# Altium project MACH_DK.PrjPcb
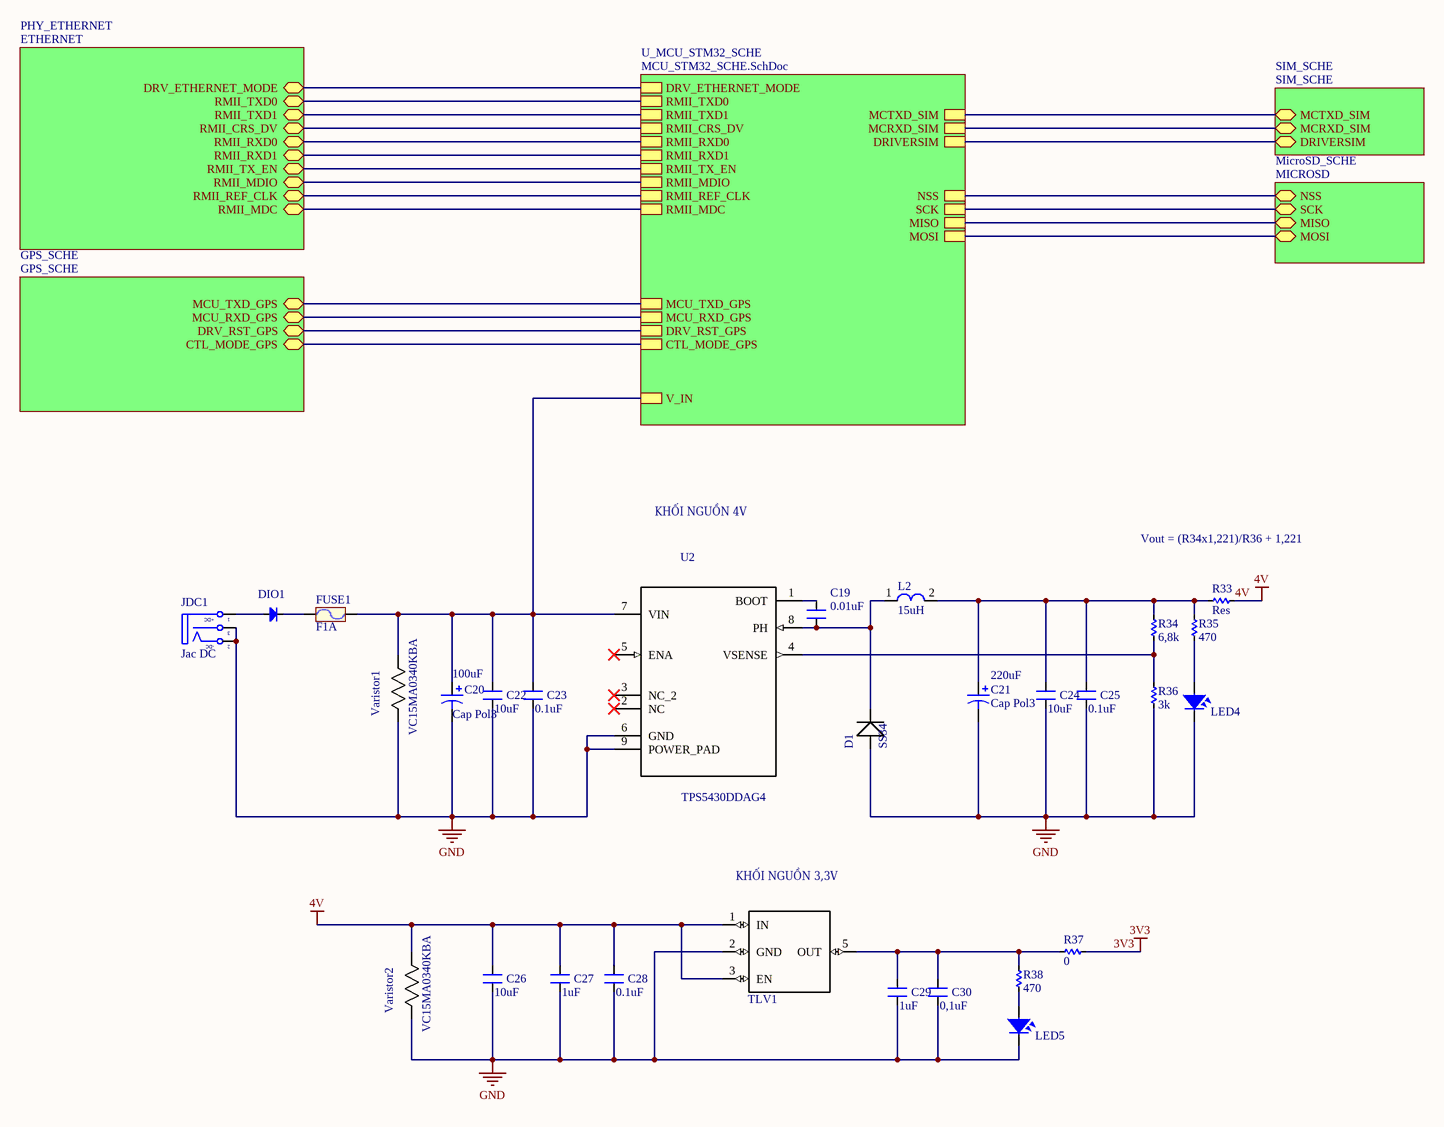
[diagram p0: MAIN_SCHE.SchDoc]
6 sheets, 213 parts. Net scope: hierarchical (ports join the sheet entries above them; power ports are global).
Board file: PCB.PcbDoc
Sheets:
  MAIN_SCHE.SchDoc
    U_MCU_STM32_SCHE = MCU_STM32_SCHE.SchDoc
    MicroSD_SCHE = MICROSD.SchDoc
    SIM_SCHE = SIM_SCHE.SchDoc
    PHY_ETHERNET = ETHERNET.SchDoc
    GPS_SCHE = GPS_SCHE.SchDoc

## Sheet MAIN_SCHE.SchDoc
size A3

### Parts
C19  0.01uF  [res 0805 - duplicate]
C20  Cap Pol3  value 100uF  [cap_100uf]
C21  Cap Pol3  value 220uF  [Cap_tant_220uF]
C22  10uF  [res 0805 - duplicate]
C23  0.1uF  [res 0805 - duplicate]
C24  10uF  [res 0805 - duplicate]
C25  0.1uF  [res 0805 - duplicate]
C26  10uF  [res 0805 - duplicate]
C27  1uF  [res 0805 - duplicate]
C28  0.1uF  [res 0805 - duplicate]
C29  1uF  [res 0805 - duplicate]
C30  0,1uF  [res 0805 - duplicate]
D1  SS34  [SS34]
DIO1  Diode SMD  [DIOT-SS24]  (value not drawn)
FUSE1  F1A  [fuse]
JDC1  Jac DC  [DC-IN]
L2  15uH  [L-15uH]
LED4  LED  [res 0805 - duplicate]  (value not drawn)
LED5  LED  [res 0805 - duplicate]  (value not drawn)
R33  Res  [res 0805 - duplicate]
R34  6,8k  [res 0805 - duplicate]
R35  470  [res 0805 - duplicate]
R36  3k  [res 0805 - duplicate]
R37  0  [res 0805 - duplicate]
R38  470  [res 0805 - duplicate]
TLV1  TLV70233DBVR  [SOT23-5]  (value not drawn)
U2  TPS5430DDAG4  [SOIC127P600X170-9N]
Varistor1  VC15MA0340KBA  [varistor]
Varistor2  VC15MA0340KBA  [varistor]

### Sub-sheets
GPS_SCHE = GPS_SCHE: MCU_TXD_GPS, MCU_RXD_GPS, DRV_RST_GPS, CTL_MODE_GPS
MicroSD_SCHE = MICROSD: NSS, SCK, MISO, MOSI
PHY_ETHERNET = ETHERNET: DRV_ETHERNET_MODE, RMII_TXD0, RMII_TXD1, RMII_CRS_DV, RMII_RXD0, RMII_RXD1, RMII_TX_EN, RMII_MDIO, RMII_REF_CLK, RMII_MDC
SIM_SCHE = SIM_SCHE: MCTXD_SIM, MCRXD_SIM, DRIVERSIM
U_MCU_STM32_SCHE = MCU_STM32_SCHE.SchDoc: DRV_ETHERNET_MODE, RMII_TXD0, RMII_TXD1, RMII_CRS_DV, RMII_RXD0, RMII_RXD1, RMII_TX_EN, MCTXD_SIM, MCRXD_SIM, DRIVERSIM, MCU_TXD_GPS, MCU_RXD_GPS, DRV_RST_GPS, CTL_MODE_GPS, NSS, SCK, MISO, MOSI, RMII_MDIO, RMII_REF_CLK, RMII_MDC, V_IN

### Nets
3V3: R37.1
4V: C26.2 C27.2 C28.2 R33.1 TLV1.1(IN) TLV1.3(EN) Varistor2.1(R1)
GND: C20.2 C21.2 C22.1 C23.1 C24.1 C25.1 C26.1 C27.1 C28.1 C29.1 C30.1 D1.1(POS) JDC1.2(TN) JDC1.3(S) LED4.2 LED5.2 R36.2 TLV1.2(GND) U2.6(GND) U2.9(POWER_PAD) Varistor1.2(R2) Varistor2.2(R2)
CTL_MODE_GPS: sheet U_MCU_STM32_SCHE/CTL_MODE_GPS, sheet GPS_SCHE/CTL_MODE_GPS
DRIVERSIM: sheet U_MCU_STM32_SCHE/DRIVERSIM, sheet SIM_SCHE/DRIVERSIM
DRV_ETHERNET_MODE: sheet U_MCU_STM32_SCHE/DRV_ETHERNET_MODE, sheet PHY_ETHERNET/DRV_ETHERNET_MODE
DRV_RST_GPS: sheet U_MCU_STM32_SCHE/DRV_RST_GPS, sheet GPS_SCHE/DRV_RST_GPS
MCRXD_SIM: sheet U_MCU_STM32_SCHE/MCRXD_SIM, sheet SIM_SCHE/MCRXD_SIM
MCTXD_SIM: sheet U_MCU_STM32_SCHE/MCTXD_SIM, sheet SIM_SCHE/MCTXD_SIM
MCU_RXD_GPS: sheet U_MCU_STM32_SCHE/MCU_RXD_GPS, sheet GPS_SCHE/MCU_RXD_GPS
MCU_TXD_GPS: sheet U_MCU_STM32_SCHE/MCU_TXD_GPS, sheet GPS_SCHE/MCU_TXD_GPS
MISO: sheet U_MCU_STM32_SCHE/MISO, sheet MicroSD_SCHE/MISO
MOSI: sheet U_MCU_STM32_SCHE/MOSI, sheet MicroSD_SCHE/MOSI
NSS: sheet U_MCU_STM32_SCHE/NSS, sheet MicroSD_SCHE/NSS
OSC_1: sheet U_MCU_STM32_SCHE/RMII_REF_CLK, sheet PHY_ETHERNET/RMII_REF_CLK
RMII_CRS_DV: sheet U_MCU_STM32_SCHE/RMII_CRS_DV, sheet PHY_ETHERNET/RMII_CRS_DV
RMII_MDC: sheet U_MCU_STM32_SCHE/RMII_MDC, sheet PHY_ETHERNET/RMII_MDC
RMII_MDIO: sheet U_MCU_STM32_SCHE/RMII_MDIO, sheet PHY_ETHERNET/RMII_MDIO
RMII_RXD0: sheet U_MCU_STM32_SCHE/RMII_RXD0, sheet PHY_ETHERNET/RMII_RXD0
RMII_RXD1: sheet U_MCU_STM32_SCHE/RMII_RXD1, sheet PHY_ETHERNET/RMII_RXD1
RMII_TX_EN: sheet U_MCU_STM32_SCHE/RMII_TX_EN, sheet PHY_ETHERNET/RMII_TX_EN
RMII_TXD0: sheet U_MCU_STM32_SCHE/RMII_TXD0, sheet PHY_ETHERNET/RMII_TXD0
RMII_TXD1: sheet U_MCU_STM32_SCHE/RMII_TXD1, sheet PHY_ETHERNET/RMII_TXD1
SCK: sheet U_MCU_STM32_SCHE/SCK, sheet MicroSD_SCHE/SCK
V_IN: C20.1 C22.2 C23.2 FUSE1.2 U2.7(VIN) Varistor1.1(R1) ; sheet U_MCU_STM32_SCHE/V_IN
NetC19_1: C19.1 D1.2(NEG) L2.1 U2.8(PH)
NetC19_2: C19.2 U2.1(BOOT)
NetC21_1: C21.1 C24.2 C25.2 L2.2 R33.2 R34.1 R35.1
NetC29_2: C29.2 C30.2 R37.2 R38.2 TLV1.5(OUT)
NetDIO1_1: DIO1.1(A) JDC1.1(T)
NetDIO1_2: DIO1.2(K) FUSE1.1
NetLED4_1: LED4.1 R35.2
NetLED5_1: LED5.1 R38.1
NetR34_2: R34.2 R36.1 U2.4(VSENSE)

Not connected (* = marked no-connect by the designer): U2 2(NC)* 3(NC_2)* 5(ENA)*

### Notes on the sheet
- KHỐI NGUỒN 4V
- Vout = (R34x1,221)/R36 + 1,221
- (near TLV1) KHỐI NGUỒN 3,3V
- (in symbol DCIN) +DC; -DC

### Library data of the parts
C19 C22-C30 = CM: Cap SMD; Value: 103
C20 C21 = Cap Pol3: Polarized Capacitor (Surface Mount); Published: 8-Jun-2000; LatestRevisionDate: 29-May-2009; LatestRevisionNote: IPC-7351 Footprint Added.; PackageReference: C0805; Publisher: Altium Limited; PackageDescription: Chip Capacitor
  C20: wed: https://www.digikey.com/product-detail/en/avx-corporation/TCJE107M020R0045/478-9462-1-ND/5001674
  C21: wed: https://www.digikey.com/product-detail/en/avx-corporation/F930J227MBA/478-8168-6-ND/4006298
D1 = SMD-DIODE-SCHOTTKY-40V-3A(DO-214AB): Rectifier, Schottky; DO-214AB; 3.0A IF; 0.75V; 40V; 100A IFRM; 10000V/us; 1000pF; MF: Vishay; MP: SS34-E3/57T; Digi-Key_Part_Number: SS34-E3/57TGICT-ND; Digi-Key_Purchase_URL: https://www.digikey.com/product-detail/en/vishay-semiconductor-diodes-division/SS34-E3-57T/SS34-E3-57TGICT-ND/1091684?utm_source=snapeda&utm_medium=aggregator&utm_campaign=symbol; SnapEDA_Link: https://www.snapeda.com/parts/SS34-E3/57T/Vishay%20Semiconductor%20Diodes%20Division/view-part/?ref=snap; Package: DO-214 Vishay; Value: *
DIO1 = Diode SMD: Default Diode; Code - JEDEC: DO-214-AB; Value: 1N5007; Published: 8-Jun-2000; Revision: July-2002: Re-released for DXP Platform.; Publisher: Altium Limited
FUSE1 = Fuse: Designed by: VanDungEvn; wed: Fuse https://www.digikey.com/product-detail/en/littelfuse-inc/0466001.NR/F1456TR-ND/521337; Value: Fuse
JDC1 = DCIN: Jac DC input; Value: Jac DC
L2 = L-SMD-1: partNo: 78477010; Manufacturer: Wurth Elektronik; Inductance: 1.0 μH; ComponentLink1Description: Manufacturer; ComponentLink1URL: http://www.we-online.de; Created by: Baojun Chen; Created Date: Nov.2015; ComponentLink2Description: Datasheet; ComponentLink2URL: http://katalog.we-online.de/pbs/datasheet/78477010.pdf
LED4 LED5 = LED SMD: Value: LED 3 - 5 ly 2 Colour
R33-R38 = Res-SMD: Resistor; Manufacturer: Generic Components; Class: Passive; Published: 08/06/2000; Publisher: Altium Hobart Technology Centre
TLV1 = TLV70233DBVR: LDO voltage regulator [Texas Instruments] TLV70233DBVR LDO voltage regulator; MP: TLV70233DBVR; Price: 0.26 USD; Availability: Good; Package: SOT-23-5 Texas Instruments; SnapEDA_Link: https://www.snapeda.com/parts/TLV70233DBVR/Texas%20Instruments/view-part/?ref=snap; MF: Texas Instruments; Value: *
U2 = TPS5430DDAG4: 5.5V to 36V Input, 3A, 500kHz Step-Down Converter 8-SO PowerPAD -40 to 125; MF: Texas Instruments; MP: TPS5430DDAG4; Availability: Good; SnapEDA_Link: https://www.snapeda.com/parts/TPS5430DDAG4/Texas%20Instruments/view-part/?ref=snap; Price: 3.69 USD; Package: SO-8 Texas Instruments; Value: *
Varistor1 Varistor2 = VC15MA0340KBA: 2220 34 VDC 4000 pF Surface Mount Multilayer Ceramic Varistor; MF: AVX; Price: 0.96 USD; MP: VC15MA0340KBA; SnapEDA_Link: https://www.snapeda.com/parts/VC15MA0340KBA/AVX/view-part/?ref=snap; Availability: Good; Package: 2220 AVX; Value: *

## Sheet MCU_STM32_SCHE.SchDoc
size A3
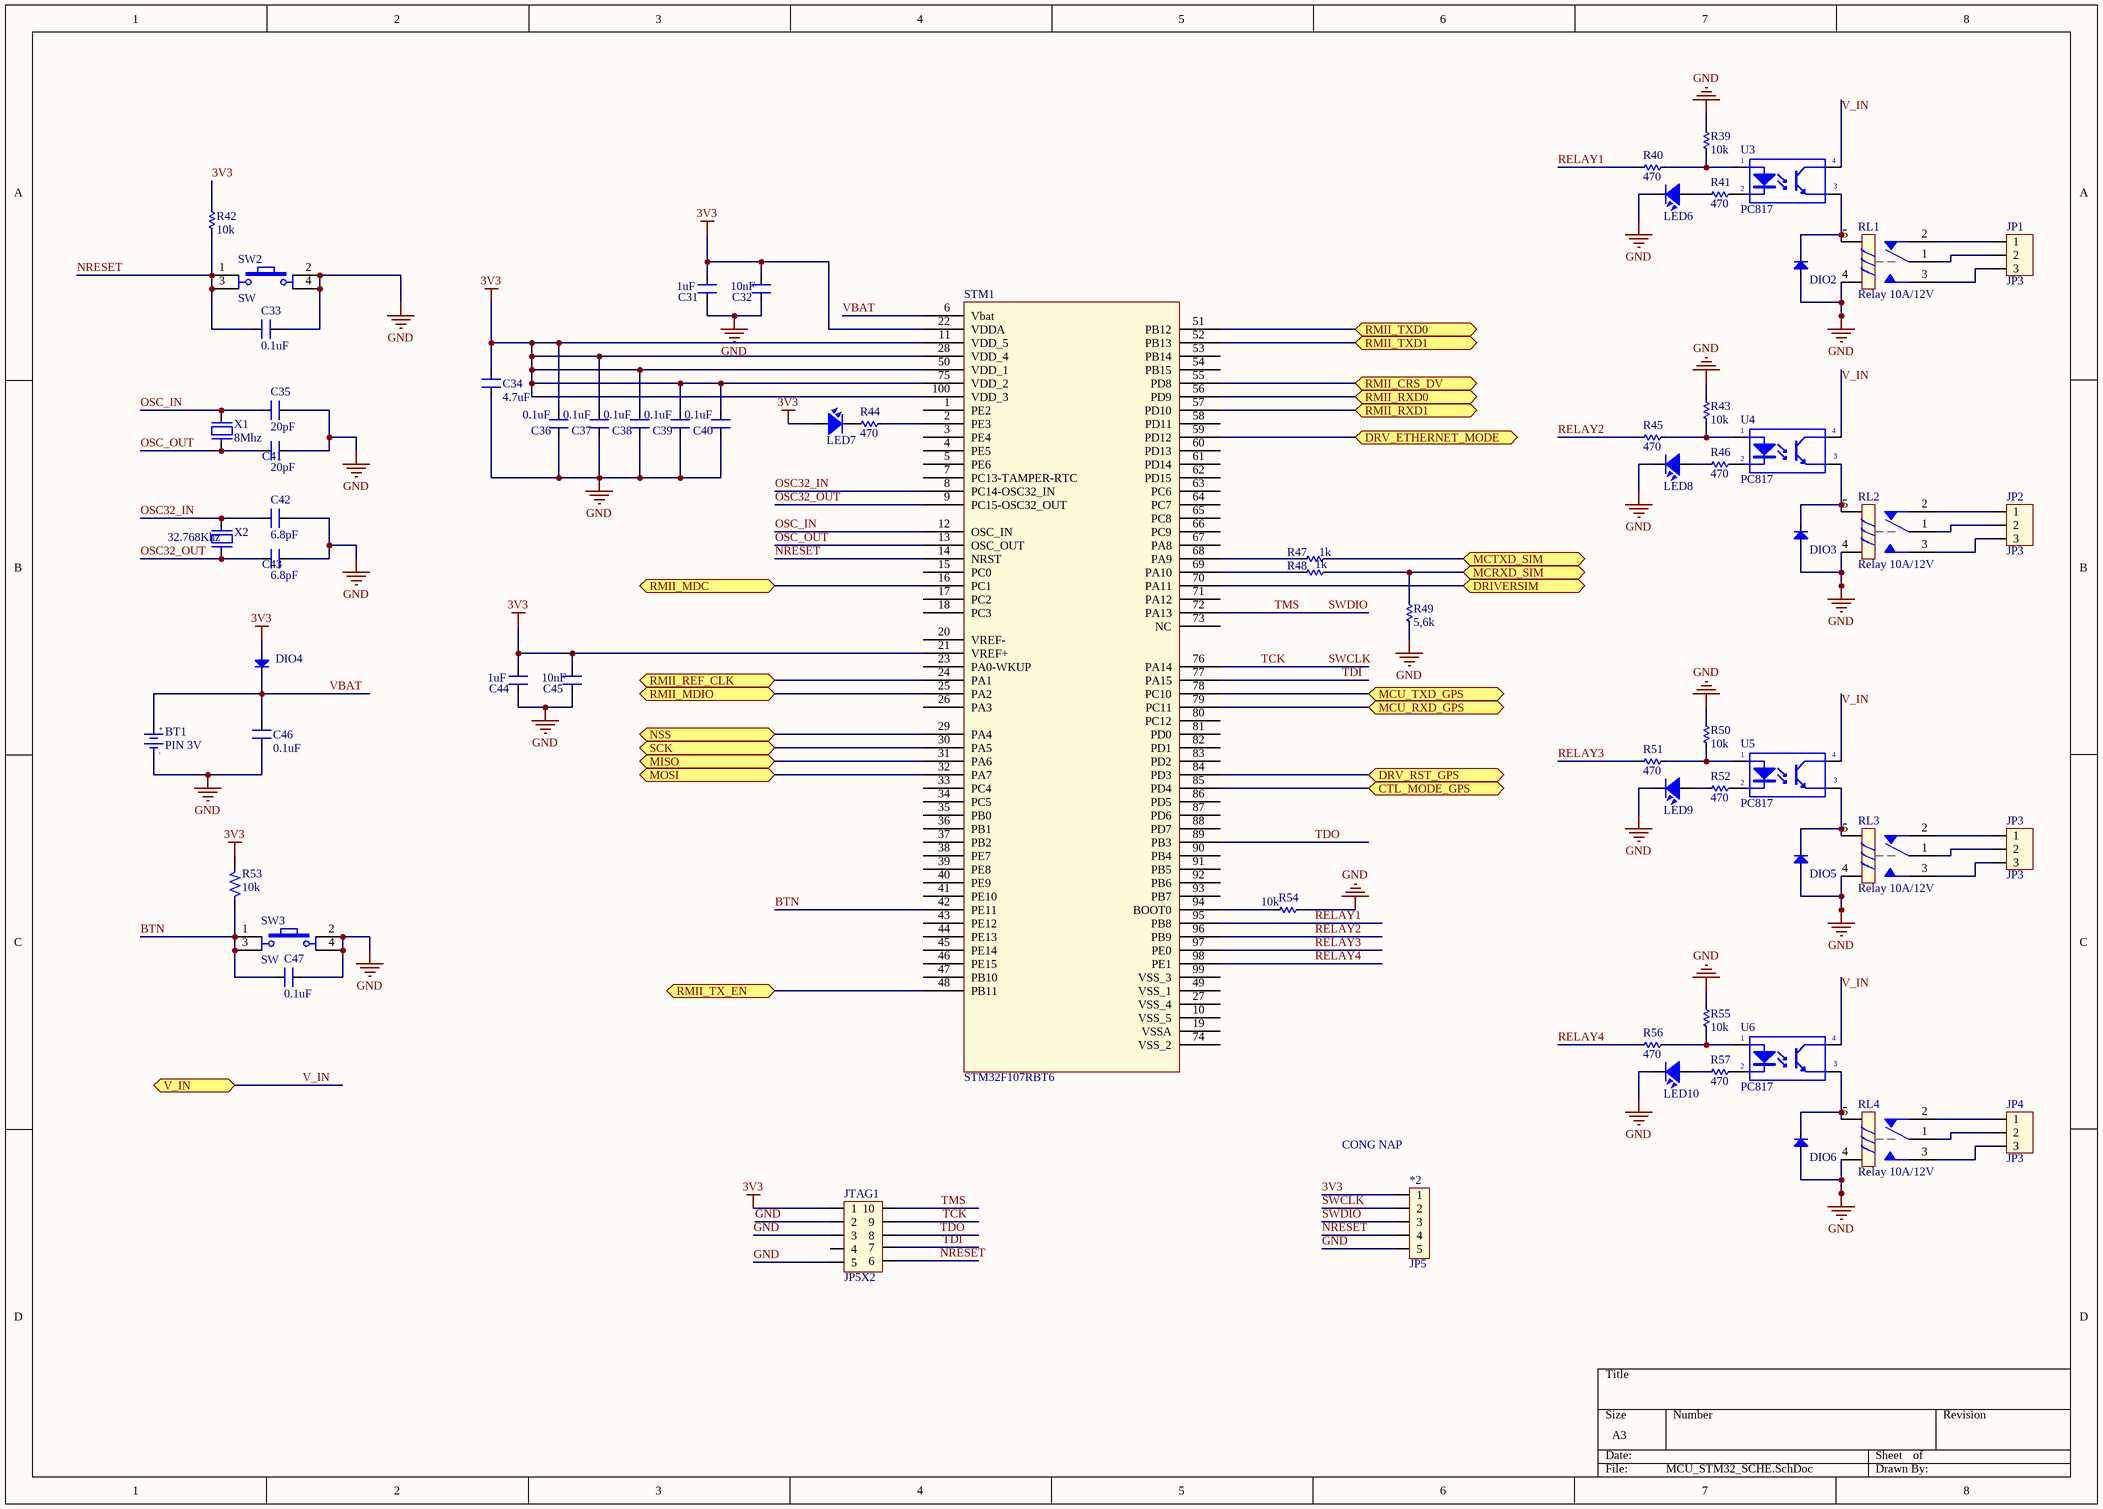
[diagram p1: MCU_STM32_SCHE.SchDoc]

### Parts
*2  JP5  [JP5]
BT1  PIN 3V  [PIN3V]
C31  1uF  [res 0805 - duplicate]
C32  10nF  [res 0805 - duplicate]
C33  0.1uF  [res 0805 - duplicate]
C34  4.7uF  [res 0805 - duplicate]
C35  20pF  [res 0805 - duplicate]
C36  0.1uF  [res 0805 - duplicate]
C37  0.1uF  [res 0805 - duplicate]
C38  0.1uF  [res 0805 - duplicate]
C39  0.1uF  [res 0805 - duplicate]
C40  0.1uF  [res 0805 - duplicate]
C41  20pF  [res 0805 - duplicate]
C42  6.8pF  [res 0805 - duplicate]
C43  6.8pF  [res 0805 - duplicate]
C44  1uF  [res 0805 - duplicate]
C45  10nF  [res 0805 - duplicate]
C46  0.1uF  [res 0805 - duplicate]
C47  0.1uF  [res 0805 - duplicate]
DIO2  Diode SMD  [DIOT-SS24]  (value not drawn)
DIO3  Diode SMD  [DIOT-SS24]  (value not drawn)
DIO4  Diode SMD  [DIO-SMD-123]  (value not drawn)
DIO5  Diode SMD  [DIOT-SS24]  (value not drawn)
DIO6  Diode SMD  [DIOT-SS24]  (value not drawn)
JP1  JP3  [CON3]
JP2  JP3  [CON3]
JP3  JP3  [CON3]
JP4  JP3  [CON3]
JTAG1  JP5X2  [JP5X2]
LED6  LED  [res 0805 - duplicate]  (value not drawn)
LED7  LED  [res 0805 - duplicate]  (value not drawn)
LED8  LED  [res 0805 - duplicate]  (value not drawn)
LED9  LED  [res 0805 - duplicate]  (value not drawn)
LED10  LED  [res 0805 - duplicate]  (value not drawn)
R39  10k  [res 0805 - duplicate]
R40  470  [res 0805 - duplicate]
R41  470  [res 0805 - duplicate]
R42  10k  [res 0805 - duplicate]
R43  10k  [res 0805 - duplicate]
R44  470  [res 0805 - duplicate]
R45  470  [res 0805 - duplicate]
R46  470  [res 0805 - duplicate]
R47  1k  [res 0805 - duplicate]
R48  1k  [res 0805 - duplicate]
R49  5,6k  [res 0805 - duplicate]
R50  10k  [res 0805 - duplicate]
R51  470  [res 0805 - duplicate]
R52  470  [res 0805 - duplicate]
R53  10k  [res 0805 - duplicate]
R54  10k  [res 0805 - duplicate]
R55  10k  [res 0805 - duplicate]
R56  470  [res 0805 - duplicate]
R57  470  [res 0805 - duplicate]
RL1  Relay 10A/12V  [RL_SPDT_10A]
RL2  Relay 10A/12V  [RL_SPDT_10A]
RL3  Relay 10A/12V  [RL_SPDT_10A]
RL4  Relay 10A/12V  [RL_SPDT_10A]
STM1  STM32F107RBT6  [STM32F107RBT6-LQFP100]
SW2  SW  [button]
SW3  SW  [button]
U3  PC817  [DIP4/W0.3]
U4  PC817  [DIP4/W0.3]
U5  PC817  [DIP4/W0.3]
U6  PC817  [DIP4/W0.3]
X1  8Mhz  [XT2]
X2  32.768Khz  [XT2]

### Ports
CTL_MODE_GPS, DRIVERSIM, DRV_ETHERNET_MODE, DRV_RST_GPS, MCRXD_SIM, MCTXD_SIM, MCU_RXD_GPS, MCU_TXD_GPS, MISO, MOSI, NSS, RMII_CRS_DV, RMII_MDC, RMII_MDIO, RMII_REF_CLK, RMII_RXD0, RMII_RXD1, RMII_TX_EN, RMII_TXD0, RMII_TXD1, SCK, V_IN

### Nets
3V3: *2.1 C31.2 C32.2 C34.2 C36.2 C37.2 C38.2 C39.2 C40.2 C44.2 C45.2 DIO4.1(A) JTAG1.1 LED7.1 R42.1 R53.2 STM1.11(VDD_5) STM1.21(VREF+) STM1.22(VDDA) STM1.28(VDD_4) STM1.50(VDD_1) STM1.75(VDD_2) STM1.100(VDD_3)
GND: *2.5 BT1.2(GND) C31.1 C32.1 C33.2 C34.1 C35.2 C36.1 C37.1 C38.1 C39.1 C40.1 C41.2 C42.2 C43.2 C44.1 C45.1 C46.1 C47.2 DIO2.1(A) DIO3.1(A) DIO5.1(A) DIO6.1(A) JTAG1.2 JTAG1.3 JTAG1.5 LED6.2 LED8.2 LED9.2 LED10.2 R39.1 R43.1 R49.2 R50.1 R54.2 R55.1 RL1.4 RL2.4 RL3.4 RL4.4 SW2.2 SW2.4 SW3.2 SW3.4
BTN: C47.1 R53.1 STM1.42(PE11) SW3.1 SW3.3
CTL_MODE_GPS: STM1.85(PD4) ; port CTL_MODE_GPS
DRIVERSIM: STM1.70(PA11) ; port DRIVERSIM
DRV_ETHERNET_MODE: STM1.59(PD12) ; port DRV_ETHERNET_MODE
DRV_RST_GPS: STM1.84(PD3) ; port DRV_RST_GPS
MCRXD_SIM: R48.1 R49.1 ; port MCRXD_SIM
MCTXD_SIM: R47.1 ; port MCTXD_SIM
MCU_RXD_GPS: STM1.79(PC11) ; port MCU_RXD_GPS
MCU_TXD_GPS: STM1.78(PC10) ; port MCU_TXD_GPS
MISO: STM1.31(PA6) ; port MISO
MOSI: STM1.32(PA7) ; port MOSI
NRESET: *2.4 C33.1 JTAG1.6 R42.2 STM1.14(NRST) SW2.1 SW2.3
NSS: STM1.29(PA4) ; port NSS
OSC32_IN: C42.1 STM1.8(PC14-OSC32_IN) X2.2
OSC32_OUT: C43.1 STM1.9(PC15-OSC32_OUT) X2.1
OSC_1: STM1.24(PA1) ; port RMII_REF_CLK
OSC_IN: C35.1 STM1.12(OSC_IN) X1.2
OSC_OUT: C41.1 STM1.13(OSC_OUT) X1.1
RELAY1: R40.2 STM1.95(PB8)
RELAY2: R45.2 STM1.96(PB9)
RELAY3: R51.2 STM1.97(PE0)
RELAY4: R56.2 STM1.98(PE1)
RMII_CRS_DV: STM1.55(PD8) ; port RMII_CRS_DV
RMII_MDC: STM1.16(PC1) ; port RMII_MDC
RMII_MDIO: STM1.25(PA2) ; port RMII_MDIO
RMII_RXD0: STM1.56(PD9) ; port RMII_RXD0
RMII_RXD1: STM1.57(PD10) ; port RMII_RXD1
RMII_TX_EN: STM1.48(PB11) ; port RMII_TX_EN
RMII_TXD0: STM1.51(PB12) ; port RMII_TXD0
RMII_TXD1: STM1.52(PB13) ; port RMII_TXD1
SCK: STM1.30(PA5) ; port SCK
SWCLK: *2.2 JTAG1.9 STM1.76(PA14)  [also labelled TCK]
SWDIO: *2.3 JTAG1.10 STM1.72(PA13)  [also labelled TMS]
TDI: JTAG1.7 STM1.77(PA15)
TDO: JTAG1.8 STM1.89(PB3)
V_IN: U3.4(C) U4.4(C) U5.4(C) U6.4(C) ; port V_IN
VBAT: BT1.1(+3V) C46.2 DIO4.2(K) STM1.6(Vbat)
NetDIO2_2: DIO2.2(K) RL1.5 U3.3(E)
NetDIO3_2: DIO3.2(K) RL2.5 U4.3(E)
NetDIO5_2: DIO5.2(K) RL3.5 U5.3(E)
NetDIO6_2: DIO6.2(K) RL4.5 U6.3(E)
NetJP1_1: JP1.1 RL1.2
NetJP1_2: JP1.2 RL1.1
NetJP1_3: JP1.3 RL1.3
NetJP2_1: JP2.1 RL2.2
NetJP2_2: JP2.2 RL2.1
NetJP2_3: JP2.3 RL2.3
NetJP3_1: JP3.1 RL3.2
NetJP3_2: JP3.2 RL3.1
NetJP3_3: JP3.3 RL3.3
NetJP4_1: JP4.1 RL4.2
NetJP4_2: JP4.2 RL4.1
NetJP4_3: JP4.3 RL4.3
NetLED6_1: LED6.1 R41.2
NetLED7_2: LED7.2 R44.2
NetLED8_1: LED8.1 R46.2
NetLED9_1: LED9.1 R52.2
NetLED10_1: LED10.1 R57.2
NetR39_2: R39.2 R40.1 U3.1(A)
NetR41_1: R41.1 U3.2(K)
NetR43_2: R43.2 R45.1 U4.1(A)
NetR44_1: R44.1 STM1.2(PE3)
NetR46_1: R46.1 U4.2(K)
NetR47_2: R47.2 STM1.68(PA9)
NetR48_2: R48.2 STM1.69(PA10)
NetR50_2: R50.2 R51.1 U5.1(A)
NetR52_1: R52.1 U5.2(K)
NetR54_1: R54.1 STM1.94(BOOT0)
NetR55_2: R55.2 R56.1 U6.1(A)
NetR57_1: R57.1 U6.2(K)

Not connected (* = marked no-connect by the designer): JTAG1 4; STM1 1(PE2) 3(PE4) 4(PE5) 5(PE6) 7(PC13-TAMPER-RTC) 10(VSS_5) 15(PC0) 17(PC2) 18(PC3) 19(VSSA) 20(VREF-) 23(PA0-WKUP) 26(PA3) 27(VSS_4) 33(PC4) 34(PC5) 35(PB0) 36(PB1) 37(PB2) 38(PE7) 39(PE8) 40(PE9) 41(PE10) 43(PE12) 44(PE13) 45(PE14) 46(PE15) 47(PB10) 49(VSS_1) 53(PB14) 54(PB15) 58(PD11) 60(PD13) 61(PD14) 62(PD15) 63(PC6) 64(PC7) 65(PC8) 66(PC9) 67(PA8) 71(PA12) 73(NC) 74(VSS_2) 80(PC12) 81(PD0) 82(PD1) 83(PD2) 86(PD5) 87(PD6) 88(PD7) 90(PB4) 91(PB5) 92(PB6) 93(PB7) 99(VSS_3)

### Notes on the sheet
- (near *2) CONG NAP
- (in symbol PIN 3V) +; -

### Library data of the parts
BT1 = PIN 3V: Battery 3VDC; Value: PIN 3V
C31-C33 C35-C47 = CM: Cap SMD; Value: 103
C34 = CN: Value: 0,1uF/300V; Designed by: VanDungEvn
DIO2-DIO6 = Diode SMD: as DIO1 on sheet MAIN_SCHE; Published: 8-Jun-2000; Revision: July-2002: Re-released for DXP Platform.; Publisher: Altium Limited
JP1-JP4 = Con3: Connector 3; Value: Connector 3
LED6-LED10 = LED SMD: Value: LED 3 - 5 ly 2 Colour
R39-R52 R54-R57 = Res-SMD: as R33 on sheet MAIN_SCHE; Published: 08/06/2000; Publisher: Altium Hobart Technology Centre
R53 = R: Resistor 1/4W; Value: R1/4W - 1K
RL1-RL4 = Relay 1: Relay SPDT,10A - 12VDC 5 Pin; Value: Relay SPDT, 10A, 12V
SW2 SW3 = SW4: Switch button 4 pin; Value: Button chip 4 pin
  SW2: wed: https://www.digikey.com/product-detail/en/c-k/PTS645SK50SMTR92-LFS/CKN9087TR-ND/1162183
U3-U6 = PC817: Single Opto; Value: PC817
X1 X2 = XT2: Crystal, 32.768 KHz, -40 to 85 degC, 3.2 x 1.5 x 0.9 mm SMD; Value: 4Mhz

## Sheet MICROSD.SchDoc
size A
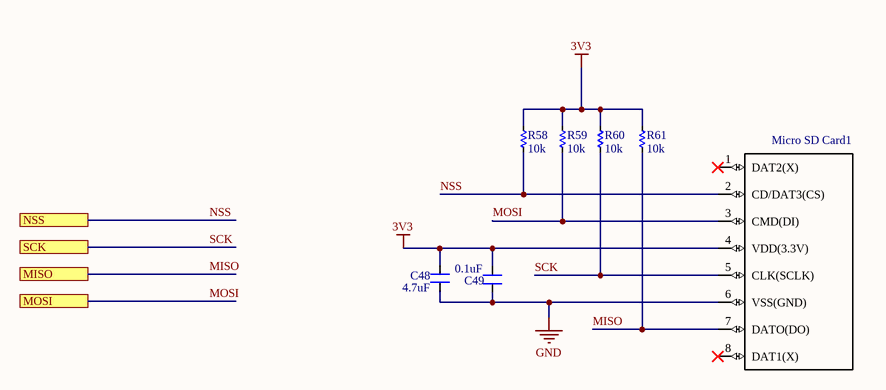
[diagram p2: MICROSD.SchDoc]

### Parts
C48  4.7uF  [res 0805 - duplicate]
C49  0.1uF  [res 0805 - duplicate]
Micro_SD_Card1  1140084168  [1140084168]  (value not drawn)
R58  10k  [res 0805 - duplicate]
R59  10k  [res 0805 - duplicate]
R60  10k  [res 0805 - duplicate]
R61  10k  [res 0805 - duplicate]

### Ports
MISO, MOSI, NSS, SCK

### Nets
3V3: C48.2 C49.2 Micro_SD_Card1.4(VDD(3.3V)) R58.1 R59.1 R60.1 R61.1
GND: C48.1 C49.1 Micro_SD_Card1.6(VSS(GND))
MISO: Micro_SD_Card1.7(DATO(DO)) R61.2 ; port MISO
MOSI: Micro_SD_Card1.3(CMD(DI)) R59.2 ; port MOSI
NSS: Micro_SD_Card1.2(CD/DAT3(CS)) R58.2 ; port NSS
SCK: Micro_SD_Card1.5(CLK(SCLK)) R60.2 ; port SCK

Not connected (* = marked no-connect by the designer): Micro_SD_Card1 1(DAT2(X))* 8(DAT1(X))*

### Library data of the parts
C48 = CN: as C34 on sheet MCU_STM32_SCHE
C49 = CM: Cap SMD; Value: 103
Micro_SD_Card1 = 1140084168: Memory Card Connector, Microsd, 8 Position, Full Reel; MF: Amphenol Commercial; MP: 114-00841-68; Price: 1.08 USD; Package: None; Availability: Warning; SnapEDA_Link: https://www.snapeda.com/parts/114-00841-68/Amphenol%20Commercial%20Products/view-part/?ref=snap; Value: *
R58-R61 = Res-SMD: as R33 on sheet MAIN_SCHE; Published: 08/06/2000; Publisher: Altium Hobart Technology Centre

## Sheet SIM_SCHE.SchDoc
size A3
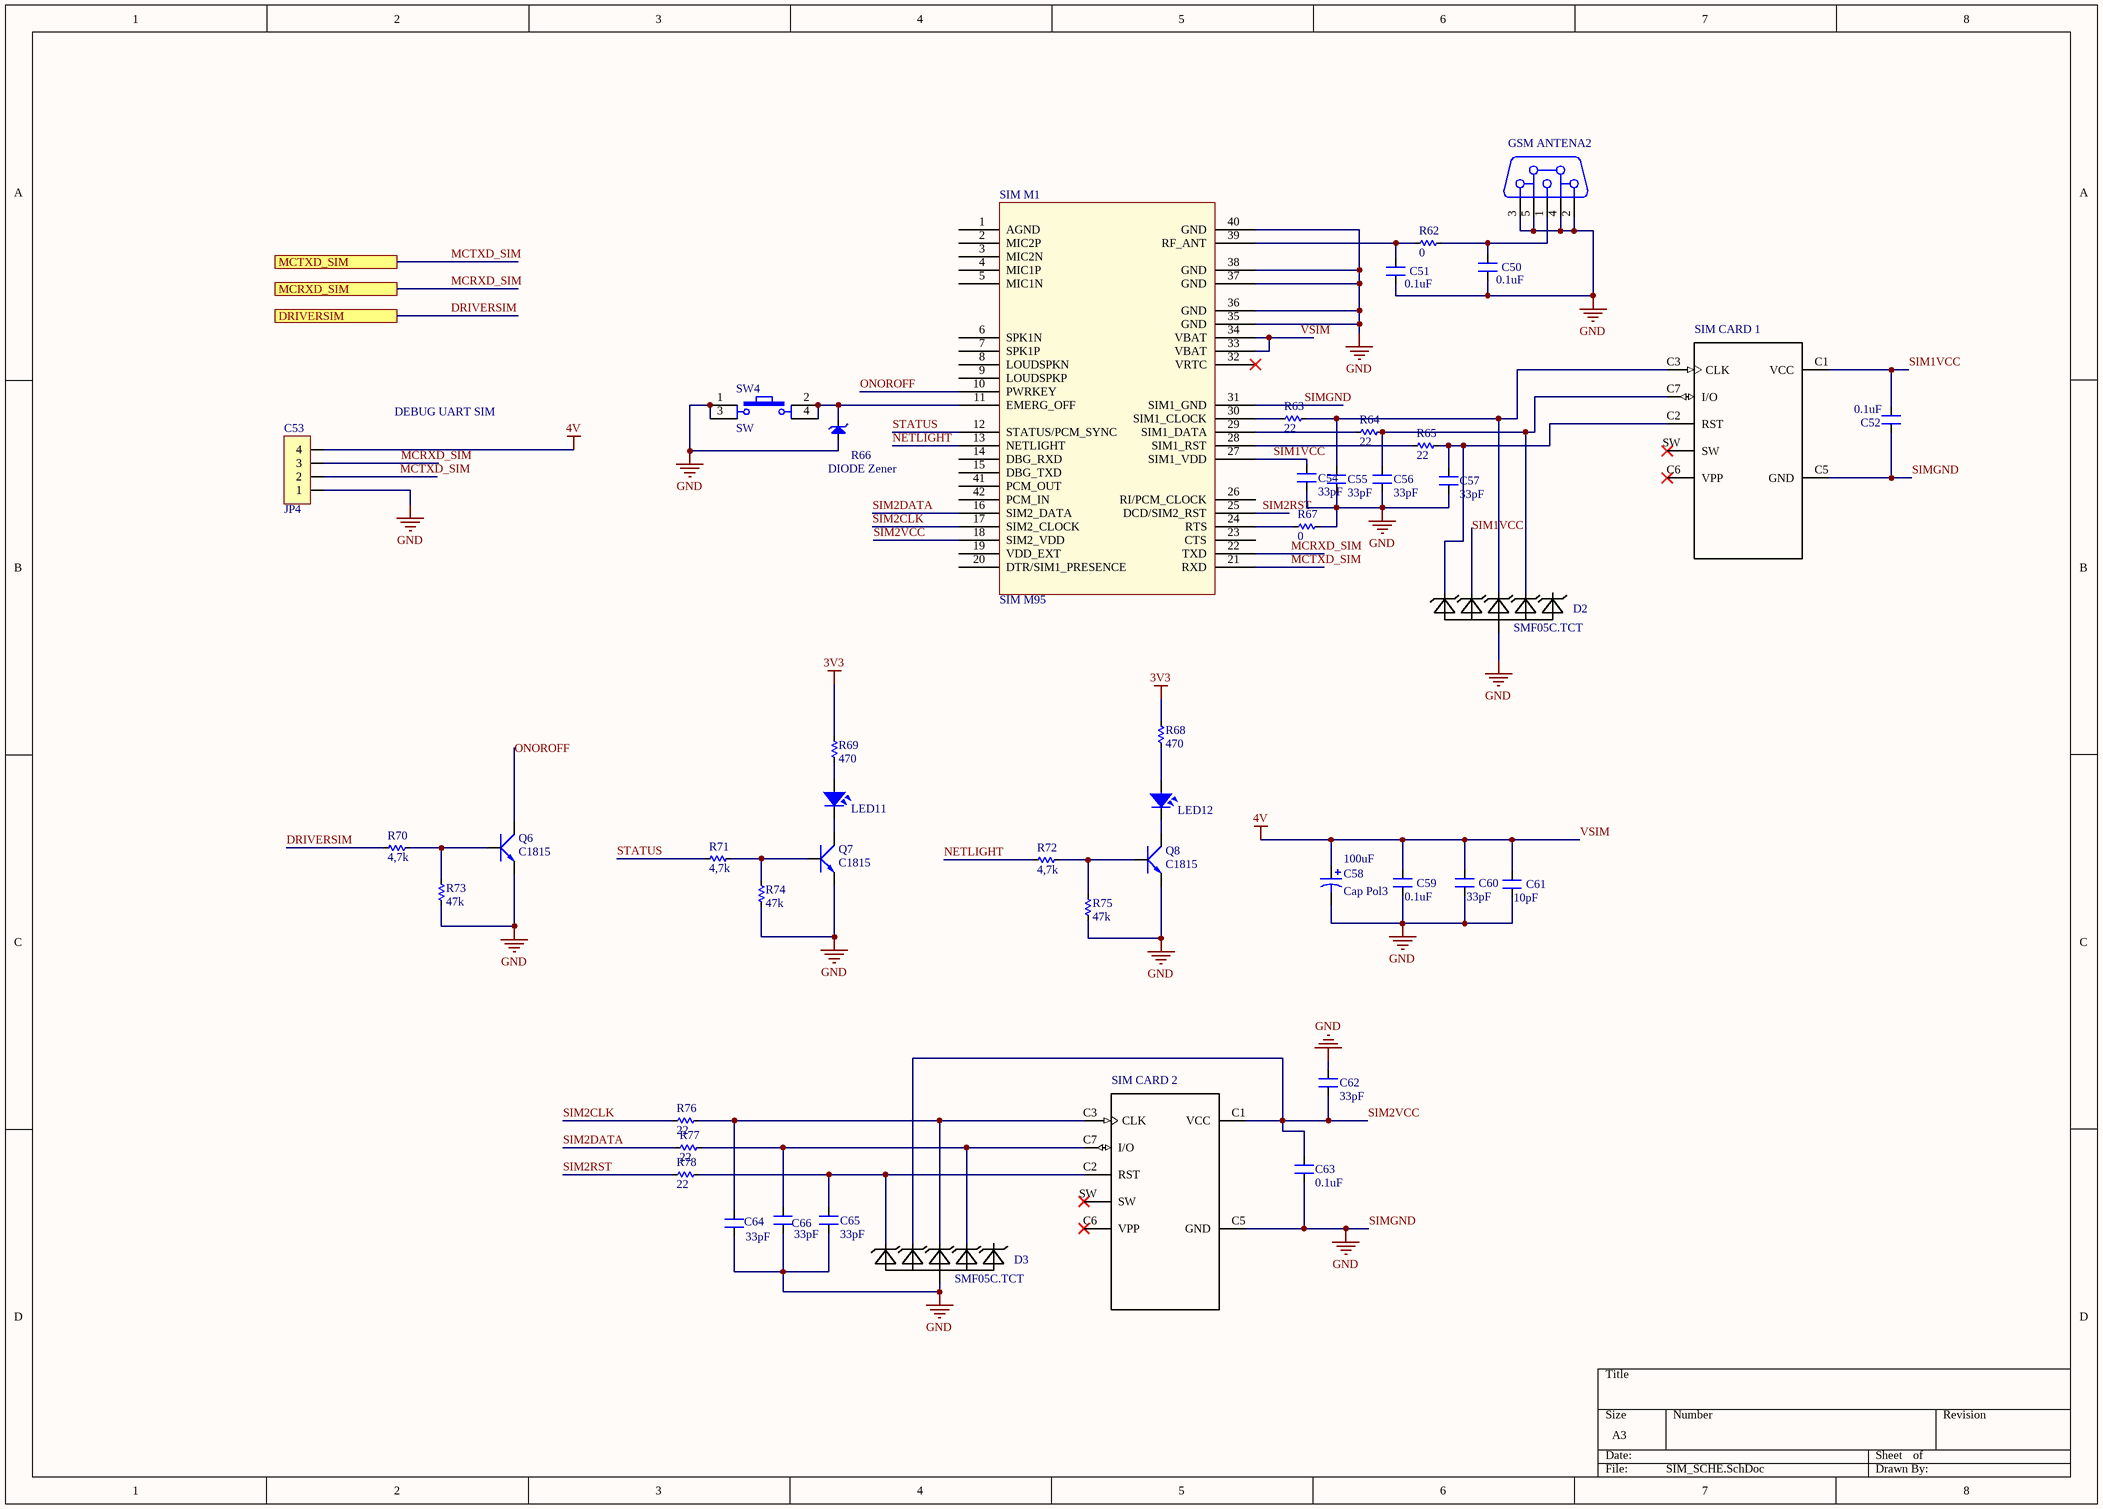
[diagram p3: SIM_SCHE.SchDoc]

### Parts
C50  0.1uF  [res 0805 - duplicate]
C51  0.1uF  [res 0805 - duplicate]
C52  0.1uF  [res 0805 - duplicate]
C53  JP4  [JP4-C1T]
C54  33pF  [res 0805 - duplicate]
C55  33pF  [res 0805 - duplicate]
C56  33pF  [res 0805 - duplicate]
C57  33pF  [res 0805 - duplicate]
C58  Cap Pol3  value 100uF  [cap_100uf]
C59  0.1uF  [res 0805 - duplicate]
C60  33pF  [res 0805 - duplicate]
C61  10pF  [res 0805 - duplicate]
C62  33pF  [res 0805 - duplicate]
C63  0.1uF  [res 0805 - duplicate]
C64  33pF  [res 0805 - duplicate]
C65  33pF  [res 0805 - duplicate]
C66  33pF  [res 0805 - duplicate]
D2  SMF05C.TCT  [SC70-6]
D3  SMF05C.TCT  [SC70-6]
GSM_ANTENA2  (no value)  [anten]
LED11  LED  [res 0805 - duplicate]  (value not drawn)
LED12  LED  [res 0805 - duplicate]  (value not drawn)
Q6  C1815  [SOT23B]
Q7  C1815  [SOT23B]
Q8  C1815  [SOT23B]
R62  0  [res 0805 - duplicate]
R63  22  [res 0805 - duplicate]
R64  22  [res 0805 - duplicate]
R65  22  [res 0805 - duplicate]
R66  DIODE Zener  [diot zenner SOD123]
R67  0  [res 0805 - duplicate]
R68  470  [res 0805 - duplicate]
R69  470  [res 0805 - duplicate]
R70  4,7k  [res 0805 - duplicate]
R71  4,7k  [res 0805 - duplicate]
R72  4,7k  [res 0805 - duplicate]
R73  47k  [res 0805 - duplicate]
R74  47k  [res 0805 - duplicate]
R75  47k  [res 0805 - duplicate]
R76  22  [res 0805 - duplicate]
R77  22  [res 0805 - duplicate]
R78  22  [res 0805 - duplicate]
SIM_CARD_1  2199337-5  [SIMCARD]  (value not drawn)
SIM_CARD_2  2199337-5  [SIMCARD]  (value not drawn)
SIM_M1  SIM M95  [SIM M95]
SW4  SW  [button]

### Ports
DRIVERSIM, MCRXD_SIM, MCTXD_SIM

### Nets
3V3: R68.1 R69.1
4V: C53.4 C58.1 C59.2 C60.2 C61.2 SIM_M1.33(VBAT) SIM_M1.34(VBAT)  [also labelled VSIM]
GND: C50.1 C51.1 C52.1 C53.1 C54.1 C55.1 C56.1 C57.1 C58.2 C59.1 C60.1 C61.1 C62.2 C63.1 C64.1 C65.1 C66.1 D2.2(A) D3.2(A) GSM_ANTENA2.2 GSM_ANTENA2.3 GSM_ANTENA2.4 GSM_ANTENA2.5 Q6.1(E) Q7.1(E) Q8.1(E) R66.1(A) R67.2 R73.2 R74.2 R75.2 SIM_CARD_1.C5(GND) SIM_CARD_2.C5(GND) SIM_M1.31(SIM1_GND) SIM_M1.35(GND) SIM_M1.36(GND) SIM_M1.37(GND) SIM_M1.38(GND) SIM_M1.40(GND) SW4.1 SW4.3  [also labelled SIMGND]
DRIVERSIM: R70.2 ; port DRIVERSIM
MCRXD_SIM: C53.3 SIM_M1.22(TXD) ; port MCRXD_SIM
MCTXD_SIM: C53.2 SIM_M1.21(RXD) ; port MCTXD_SIM
NETLIGHT: R72.2 SIM_M1.13(NETLIGHT)
ONOROFF: Q6.2(C) SIM_M1.10(PWRKEY)
SIM1VCC: C52.2 C54.2 D2.3(C2) SIM_CARD_1.C1(VCC) SIM_M1.27(SIM1_VDD)
SIM2CLK: R76.2 SIM_M1.17(SIM2_CLOCK)
SIM2DATA: R77.2 SIM_M1.16(SIM2_DATA)
SIM2RST: R78.2 SIM_M1.25(DCD/SIM2_RST)
SIM2VCC: C62.1 C63.2 D3.3(C2) SIM_CARD_2.C1(VCC) SIM_M1.18(SIM2_VDD)
STATUS: R71.2 SIM_M1.12(STATUS/PCM_SYNC)
NetC50_2: C50.2 GSM_ANTENA2.1 R62.2
NetC51_2: C51.2 R62.1 SIM_M1.39(RF_ANT)
NetC55_2: C55.2 D2.4(C3) R63.2 SIM_CARD_1.C3(CLK)
NetC56_2: C56.2 D2.5(C4) R64.2 SIM_CARD_1.C7(I/O)
NetC57_2: C57.2 D2.1(C1) R65.2 SIM_CARD_1.C2(RST)
NetC64_2: C64.2 D3.4(C3) R76.1 SIM_CARD_2.C3(CLK)
NetC65_2: C65.2 D3.1(C1) R78.1 SIM_CARD_2.C2(RST)
NetC66_2: C66.2 D3.5(C4) R77.1 SIM_CARD_2.C7(I/O)
NetLED11_1: LED11.1 R69.2
NetLED11_2: LED11.2 Q7.2(C)
NetLED12_1: LED12.1 R68.2
NetLED12_2: LED12.2 Q8.2(C)
NetQ6_3: Q6.3(B) R70.1 R73.1
NetQ7_3: Q7.3(B) R71.1 R74.1
NetQ8_3: Q8.3(B) R72.1 R75.1
NetR63_1: R63.1 SIM_M1.30(SIM1_CLOCK)
NetR64_1: R64.1 SIM_M1.29(SIM1_DATA)
NetR65_1: R65.1 SIM_M1.28(SIM1_RST)
NetR66_2: R66.2(K) SIM_M1.11(EMERG_OFF) SW4.2 SW4.4
NetR67_1: R67.1 SIM_M1.24(RTS)

Not connected (* = marked no-connect by the designer): D2 6(C5); D3 6(C5); SIM_CARD_1 C6(VPP)* SW*; SIM_CARD_2 C6(VPP)* SW*; SIM_M1 1(AGND) 2(MIC2P) 3(MIC2N) 4(MIC1P) 5(MIC1N) 6(SPK1N) 7(SPK1P) 8(LOUDSPKN) 9(LOUDSPKP) 14(DBG_RXD) 15(DBG_TXD) 19(VDD_EXT) 20(DTR/SIM1_PRESENCE) 23(CTS) 26(RI/PCM_CLOCK) 32(VRTC)* 41(PCM_OUT) 42(PCM_IN)

### Notes on the sheet
- DEBUG UART SIM

### Library data of the parts
C50-C52 C59-C61 = CM: Cap SMD; Value: 103
C53 = JP4: WR-PHD 2.54 mm Angled Socket Header; Manufacturer: W¨¹rth Elektronik eiSos GmbH; partNo: 613004143121; ComponentLink1 Description: Manufacturer; ComponentLink2 Description: Datasheet; NoPins: 04; Created Date: 29 March 2013; ComponentLink1URL: http://www.we-online.com; ComponentLink2URL: http://katalog.we-online.de/em/datasheet/6130xx143121.pdf; Created by: Karrer Zheng
C54-C57 C62-C66 = CN: as C34 on sheet MCU_STM32_SCHE
C58 = Cap Pol3: Polarized Capacitor (Surface Mount); Published: 8-Jun-2000; LatestRevisionDate: 29-May-2009; LatestRevisionNote: IPC-7351 Footprint Added.; PackageReference: C0805; Publisher: Altium Limited; PackageDescription: Chip Capacitor
D2 D3 = SMF05C.TCT: MF: Semtech; Price: None; Package: SOT-363 Diodes Inc.; SnapEDA_Link: https://www.snapeda.com/parts/SMF05C.TCT/Semtech%20Corporation/view-part/?ref=snap; Availability: Unavailable; MP: SMF05C.TCT; Value: *
GSM_ANTENA2 = CON Ant: CONNECTOR ANTEN; partNo: 210111003; Manufacturer: Würth Elektronik eiSos GmbH; ComponentLink1Description: Manufacturer; ComponentLink1URL: http://www.we-online.de; Created by: Christin Zierenner; Created Date: May 2012; ComponentLink2Description: Datasheet; ComponentLink2URL: http://katalog.we-online.de/kataloge/eisos/index.php?language=en&pf=Filter_gerade
LED11 LED12 = LED SMD: Value: LED 3 - 5 ly 2 Colour
Q6-Q8 = C1815: NPN 600mW, ECB; Value: C1815
R62-R65 R67-R78 = Res-SMD: as R33 on sheet MAIN_SCHE; Published: 08/06/2000; Publisher: Altium Hobart Technology Centre
R66 = DIODE Zener: Zenner
SIM_CARD_1 SIM_CARD_2 = 2199337-5: ASS'Y FOR MICRO SIM H1.18 8POS _EMBOSS_; Number_of_Positions: 8; Product_Type: Connector; Centerline_Pitch: 2.54 mm[.1 in]; MF: TE Connectivity; SnapEDA_Link: https://www.snapeda.com/parts/2199337-5/TE%20Connectivity%20AMP%20Connectors/view-part/?ref=snap; MP: 2199337-5; EU_RoHS_Compliance: Compliant; Price: 1.11 USD; Availability: Good; Package: None; Link: http://www.te.com/usa-en/product-2199337-5.html; Value: *
SW4 = SW4: as SW2 on sheet MCU_STM32_SCHE

## Sheet ETHERNET.SchDoc
size A3
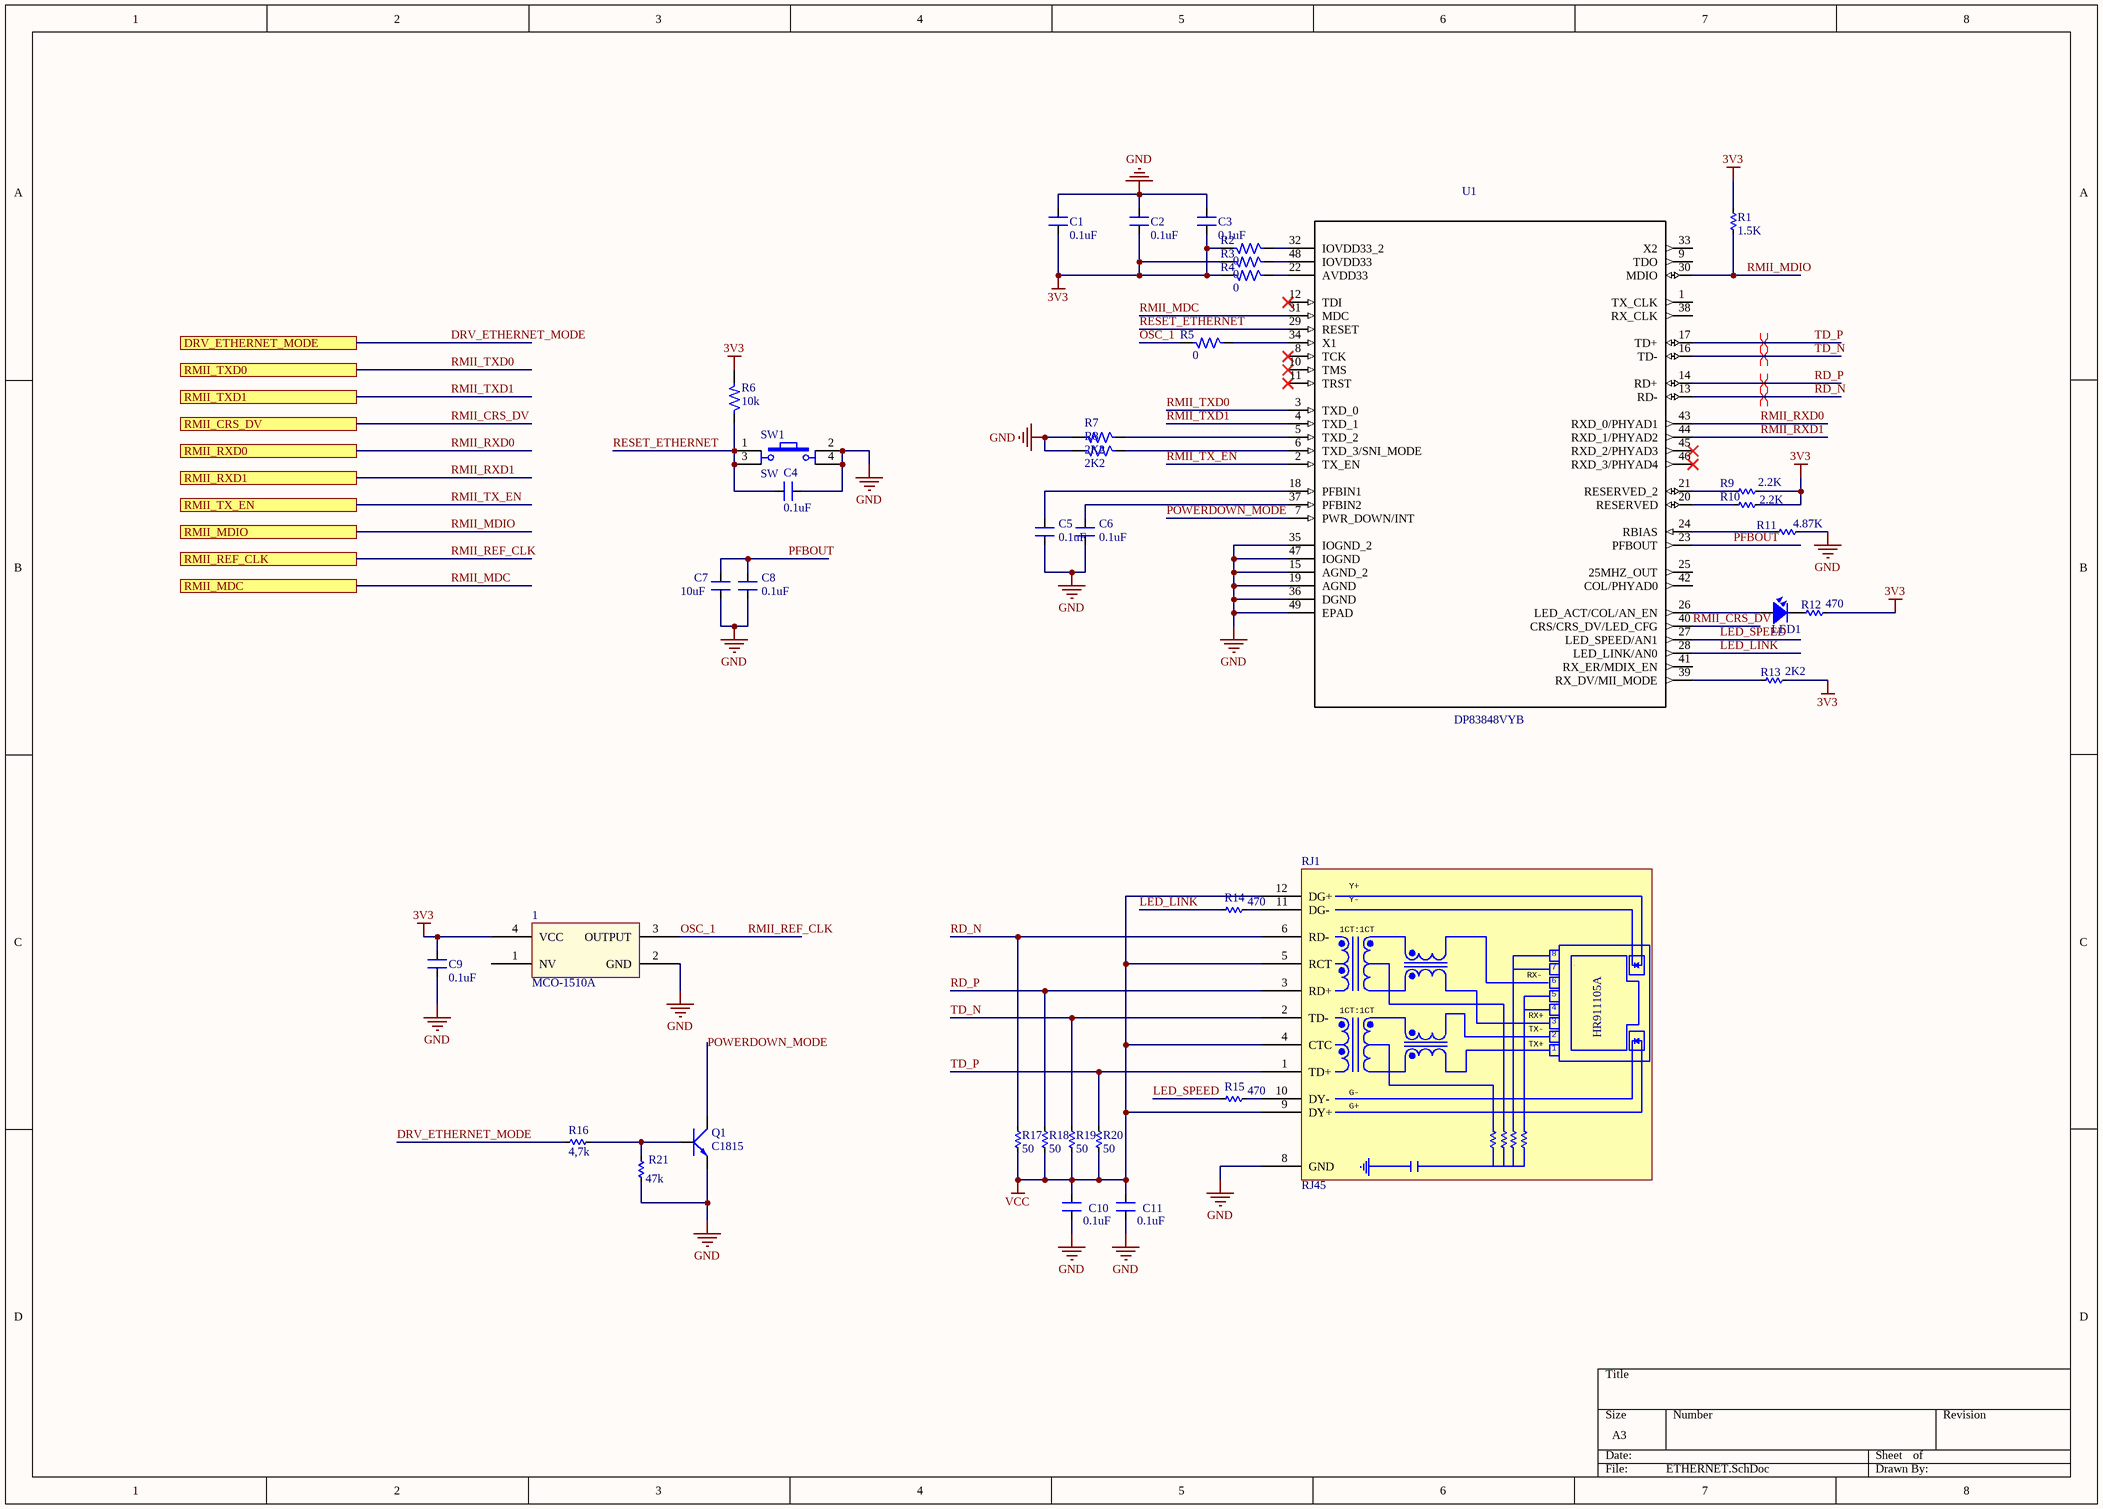
[diagram p4: ETHERNET.SchDoc]

### Parts
1  MCO-1510A  [OSC_1510B]
C1  0.1uF  [res 0805 - duplicate]
C2  0.1uF  [res 0805 - duplicate]
C3  0.1uF  [res 0805 - duplicate]
C4  0.1uF  [res 0805 - duplicate]
C5  0.1uF  [res 0805 - duplicate]
C6  0.1uF  [res 0805 - duplicate]
C7  10uF  [res 0805 - duplicate]
C8  0.1uF  [res 0805 - duplicate]
C9  0.1uF  [res 0805 - duplicate]
C10  0.1uF  [res 0805 - duplicate]
C11  0.1uF  [res 0805 - duplicate]
LED1  LED  [res 0805 - duplicate]  (value not drawn)
Q1  C1815  [SOT23B]
R1  1.5K  [res 0805 - duplicate]
R2  0  [res 0805 - duplicate]
R3  0  [res 0805 - duplicate]
R4  0  [res 0805 - duplicate]
R5  0  [res 0805 - duplicate]
R6  10k  [res 0805 - duplicate]
R7  2K2  [res 0805 - duplicate]
R8  2K2  [res 0805 - duplicate]
R9  2.2K  [res 0805 - duplicate]
R10  2.2K  [res 0805 - duplicate]
R11  4.87K  [res 0805 - duplicate]
R12  470  [res 0805 - duplicate]
R13  2K2  [res 0805 - duplicate]
R14  470  [res 0805 - duplicate]
R15  470  [res 0805 - duplicate]
R16  4,7k  [res 0805 - duplicate]
R17  50  [res 0805 - duplicate]
R18  50  [res 0805 - duplicate]
R19  50  [res 0805 - duplicate]
R20  50  [res 0805 - duplicate]
R21  47k  [res 0805 - duplicate]
RJ1  RJ45  [RJ45 Tranfomer]
SW1  SW  [button]
U1  DP83848VYB  [QFP50P900X900X160-49N]

### Ports
DRV_ETHERNET_MODE, RMII_CRS_DV, RMII_MDC, RMII_MDIO, RMII_REF_CLK, RMII_RXD0, RMII_RXD1, RMII_TX_EN, RMII_TXD0, RMII_TXD1

### Nets
3V3: 1.4(VCC) C1.2 C2.2 C3.2 C9.2 R1.1 R2.2 R3.2 R4.2 R6.2 R9.1 R10.1 R12.1 R13.1
GND: 1.2(GND) C1.1 C2.1 C3.1 C4.2 C5.1 C6.1 C7.1 C8.1 C9.1 C10.1 C11.1 Q1.1(E) R7.2 R8.2 R11.1 R21.1 RJ1.8(GND) SW1.2 SW1.4 U1.15(AGND_2) U1.19(AGND) U1.35(IOGND_2) U1.36(DGND) U1.47(IOGND) U1.49(EPAD)
VCC: C10.2 C11.2 R17.1 R18.1 R19.1 R20.1 RJ1.4(CTC) RJ1.5(RCT) RJ1.9(DY+) RJ1.12(DG+)
DRV_ETHERNET_MODE: R16.1 ; port DRV_ETHERNET_MODE
LED_LINK: R14.1 U1.28(LED_LINK/AN0)
LED_SPEED: R15.1 U1.27(LED_SPEED/AN1)
OSC_1: 1.3(OUTPUT) R5.2 ; port RMII_REF_CLK  [also labelled RMII_REF_CLK]
PFBOUT: C7.2 C8.2 U1.23(PFBOUT)
POWERDOWN_MODE: Q1.2(C) U1.7(PWR_DOWN/INT)
RD_N: R17.2 RJ1.6(RD-) U1.13(RD-)
RD_P: R18.2 RJ1.3(RD+) U1.14(RD+)
RESET_ETHERNET: C4.1 R6.1 SW1.1 SW1.3 U1.29(RESET)
RMII_CRS_DV: U1.40(CRS/CRS_DV/LED_CFG) ; port RMII_CRS_DV
RMII_MDC: U1.31(MDC) ; port RMII_MDC
RMII_MDIO: R1.2 U1.30(MDIO) ; port RMII_MDIO
RMII_RXD0: U1.43(RXD_0/PHYAD1) ; port RMII_RXD0
RMII_RXD1: U1.44(RXD_1/PHYAD2) ; port RMII_RXD1
RMII_TX_EN: U1.2(TX_EN) ; port RMII_TX_EN
RMII_TXD0: U1.3(TXD_0) ; port RMII_TXD0
RMII_TXD1: U1.4(TXD_1) ; port RMII_TXD1
TD_N: R19.2 RJ1.2(TD-) U1.16(TD-)
TD_P: R20.2 RJ1.1(TD+) U1.17(TD+)
NetC5_2: C5.2 U1.18(PFBIN1)
NetC6_2: C6.2 U1.37(PFBIN2)
NetLED1_1: LED1.1 U1.26(LED_ACT/COL/AN_EN)
NetLED1_2: LED1.2 R12.2
NetQ1_3: Q1.3(B) R16.2 R21.2
NetR2_1: R2.1 U1.32(IOVDD33_2)
NetR3_1: R3.1 U1.48(IOVDD33)
NetR4_1: R4.1 U1.22(AVDD33)
NetR5_1: R5.1 U1.34(X1)
NetR7_1: R7.1 U1.5(TXD_2)
NetR8_1: R8.1 U1.6(TXD_3/SNI_MODE)
NetR9_2: R9.2 U1.21(RESERVED_2)
NetR10_2: R10.2 U1.20(RESERVED)
NetR11_2: R11.2 U1.24(RBIAS)
NetR13_2: R13.2 U1.39(RX_DV/MII_MODE)
NetR14_2: R14.2 RJ1.11(DG-)
NetR15_2: R15.2 RJ1.10(DY-)

Not connected (* = marked no-connect by the designer): 1 1(NV); U1 1(TX_CLK) 8(TCK)* 9(TDO) 10(TMS)* 11(TRST)* 12(TDI)* 25(25MHZ_OUT) 33(X2) 38(RX_CLK) 41(RX_ER/MDIX_EN) 42(COL/PHYAD0) 45(RXD_2/PHYAD3)* 46(RXD_3/PHYAD4)*

### Layout directives
differential pair: RD_N, RD_P, TD_N, TD_P

### Notes on the sheet
- (in symbol RJ45 - Tranfomer) Y+; Y-; 1CT:1CT; 7; RX-; RX+; TX-; HR911105A; TX+; G-; G+

### Library data of the parts
1 = OSC50MhZ: WED: http://banlinhkien.vn/goods-3053-osc-50mhz-4-chan-mco-1510a.html
C1-C11 = CM: Cap SMD; Value: 103
LED1 = LED SMD: Value: LED 3 - 5 ly 2 Colour
Q1 = C1815: NPN 600mW, ECB; Value: C1815
R1 R9-R21 = Res-SMD: as R33 on sheet MAIN_SCHE; Published: 08/06/2000; Publisher: Altium Hobart Technology Centre
R2-R8 = R: Resistor 1/4W; Value: R1/4W - 1K
RJ1 = RJ45 - Tranfomer
SW1 = SW4: as SW2 on sheet MCU_STM32_SCHE
U1 = DP83848VYB: PHYTER Extended Temperature Single Port 10/100 Mb/s Ethernet Physical Layer Transceiver 48-HLQFP -40 to 105; MF: Texas Instruments; MP: DP83848VYB/NOPB; SnapEDA_Link: https://www.snapeda.com/parts/DP83848VYB/NOPB/Texas%20Instruments/view-part/?ref=snap; Price: 20.53 USD; Availability: Good; Package: LQFP-48 Texas Instruments; Value: *

## Sheet GPS_SCHE.SchDoc
size A4
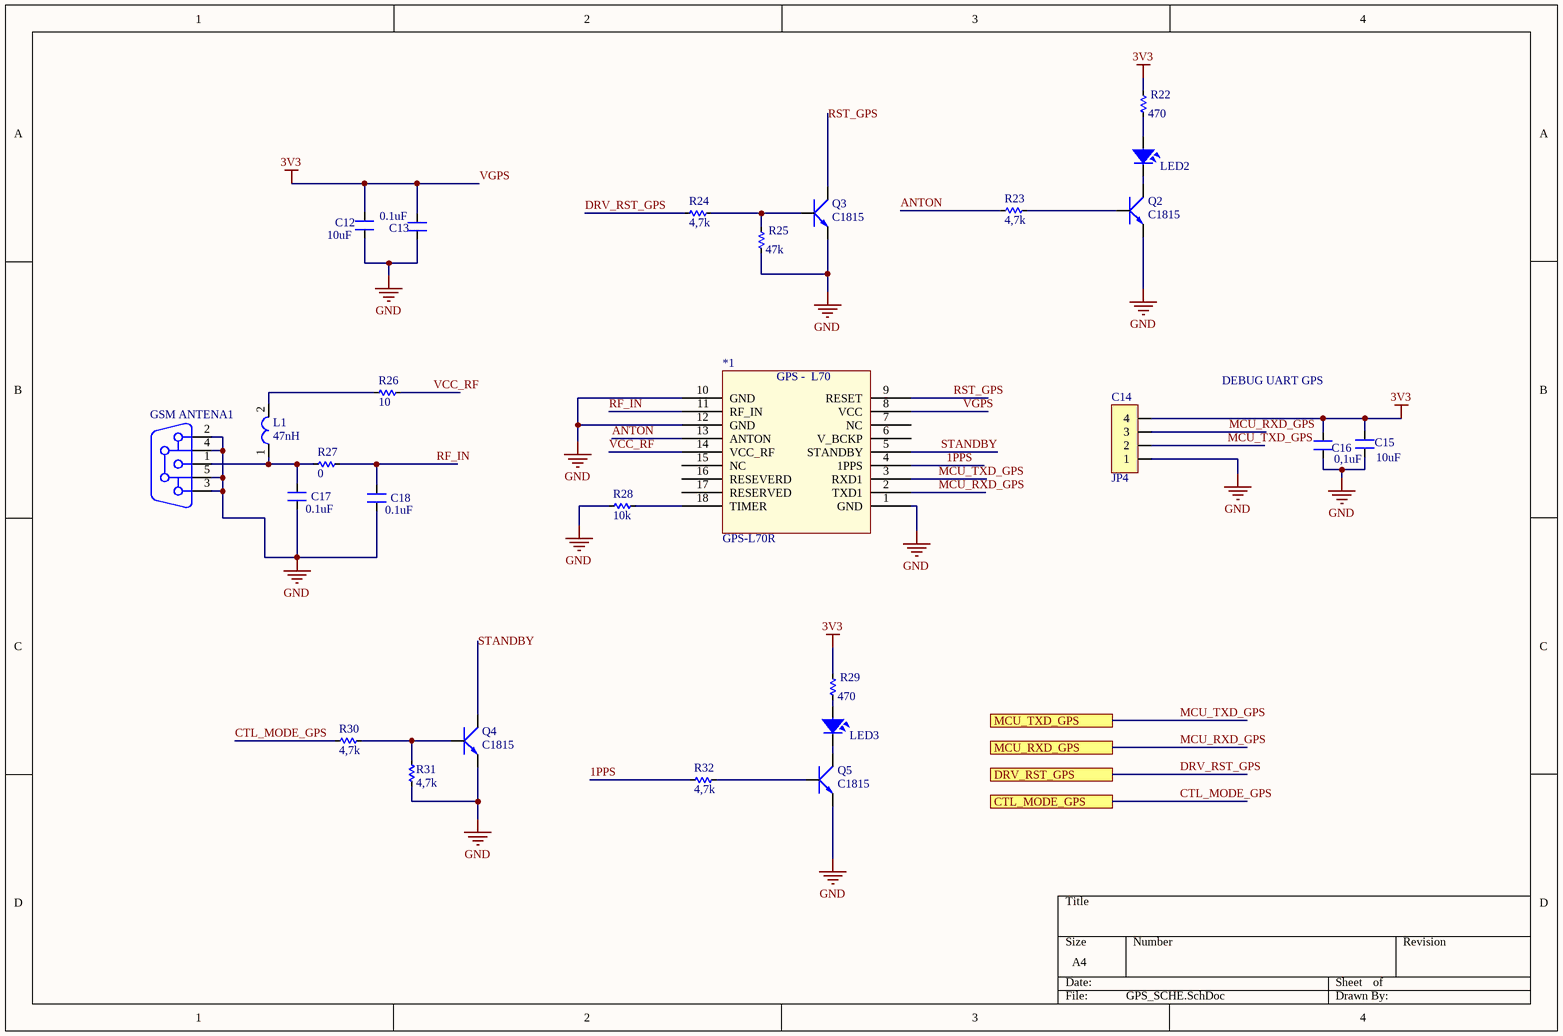
[diagram p5: GPS_SCHE.SchDoc]

### Parts
*1  GPS-L70R  [GPS_L70R]
C12  10uF  [res 0805 - duplicate]
C13  0.1uF  [res 0805 - duplicate]
C14  JP4  [JP4-C1T]
C15  10uF  [res 0805 - duplicate]
C16  0,1uF  [res 0805 - duplicate]
C17  0.1uF  [res 0805 - duplicate]
C18  0.1uF  [res 0805 - duplicate]
GSM_ANTENA1  (no value)  [anten]
L1  47nH  [res 0805 - duplicate]
LED2  LED  [res 0805 - duplicate]  (value not drawn)
LED3  LED  [res 0805 - duplicate]  (value not drawn)
Q2  C1815  [SOT23B]
Q3  C1815  [SOT23B]
Q4  C1815  [SOT23B]
Q5  C1815  [SOT23B]
R22  470  [res 0805 - duplicate]
R23  4,7k  [res 0805 - duplicate]
R24  4,7k  [res 0805 - duplicate]
R25  47k  [res 0805 - duplicate]
R26  10  [res 0805 - duplicate]
R27  0  [res 0805 - duplicate]
R28  10k  [res 0805 - duplicate]
R29  470  [res 0805 - duplicate]
R30  4,7k  [res 0805 - duplicate]
R31  4,7k  [res 0805 - duplicate]
R32  4,7k  [res 0805 - duplicate]

### Ports
CTL_MODE_GPS, DRV_RST_GPS, MCU_RXD_GPS, MCU_TXD_GPS

### Nets
3V3: *1.8(VCC) C12.2 C13.2 C14.4 C15.2 C16.2 R22.2 R29.2  [also labelled VGPS]
GND: *1.1(GND) *1.10(GND) *1.12(GND) C12.1 C13.1 C14.1 C15.1 C16.1 C17.1 C18.1 GSM_ANTENA1.2 GSM_ANTENA1.3 GSM_ANTENA1.4 GSM_ANTENA1.5 Q2.1(E) Q3.1(E) Q4.1(E) Q5.1(E) R25.1 R28.1 R31.1
1PPS: *1.4(1PPS) R32.1
ANTON: *1.13(ANTON) R23.1
CTL_MODE_GPS: R30.1 ; port CTL_MODE_GPS
DRV_RST_GPS: R24.1 ; port DRV_RST_GPS
MCU_RXD_GPS: *1.2(TXD1) C14.3 ; port MCU_RXD_GPS
MCU_TXD_GPS: *1.3(RXD1) C14.2 ; port MCU_TXD_GPS
RF_IN: *1.11(RF_IN) C18.2 R27.2
RST_GPS: *1.9(RESET) Q3.2(C)
STANDBY: *1.5(STANDBY) Q4.2(C)
VCC_RF: *1.14(VCC_RF) R26.2
Net*1_18: *1.18(TIMER) R28.2
NetC17_2: C17.2 GSM_ANTENA1.1 L1.1 R27.1
NetL1_2: L1.2 R26.1
NetLED2_1: LED2.1 R22.1
NetLED2_2: LED2.2 Q2.2(C)
NetLED3_1: LED3.1 R29.1
NetLED3_2: LED3.2 Q5.2(C)
NetQ2_3: Q2.3(B) R23.2
NetQ3_3: Q3.3(B) R24.2 R25.2
NetQ4_3: Q4.3(B) R30.2 R31.2
NetQ5_3: Q5.3(B) R32.2

Not connected (* = marked no-connect by the designer): *1 6(V_BCKP) 7(NC) 15(NC) 16(RESEVERD) 17(RESERVED)

### Notes on the sheet
- DEBUG UART GPS
- (in symbol GPS-L70) GPS -  L70

### Library data of the parts
*1 = GPS-L70
C12 C15 C16 = CN: as C34 on sheet MCU_STM32_SCHE
C13 C17 C18 = CM: Cap SMD; Value: 103
C14 = JP4: as C53 on sheet SIM_SCHE; Created Date: 29 March 2013; ComponentLink1URL: http://www.we-online.com; ComponentLink2URL: http://katalog.we-online.de/em/datasheet/6130xx143121.pdf; Created by: Karrer Zheng
GSM_ANTENA1 = CON Ant: as GSM_ANTENA2 on sheet SIM_SCHE; ComponentLink1Description: Manufacturer; ComponentLink1URL: http://www.we-online.de; Created by: Christin Zierenner; Created Date: May 2012; ComponentLink2Description: Datasheet; ComponentLink2URL: http://katalog.we-online.de/kataloge/eisos/index.php?language=en&pf=Filter_gerade
L1 = L-SMD-1: as L2 on sheet MAIN_SCHE; ComponentLink1Description: Manufacturer; ComponentLink1URL: http://www.we-online.de; Created by: Baojun Chen; Created Date: Nov.2015; ComponentLink2Description: Datasheet; ComponentLink2URL: http://katalog.we-online.de/pbs/datasheet/78477010.pdf; WED: https://www.digikey.com/product-detail/en/wurth-electronics-inc/744786147A/732-6271-2-ND/5087158
LED2 LED3 = LED SMD: Value: LED 3 - 5 ly 2 Colour
Q2-Q5 = C1815: NPN 600mW, ECB; Value: C1815
R22-R32 = Res-SMD: as R33 on sheet MAIN_SCHE; Published: 08/06/2000; Publisher: Altium Hobart Technology Centre

## Nets that join several sheets
3V3: MAIN_SCHE (R37.1), MCU_STM32_SCHE (23 pins), MICROSD (7 pins), SIM_SCHE (R68.1 R69.1), ETHERNET (14 pins), GPS_SCHE (8 pins)
4V: MAIN_SCHE (7 pins), SIM_SCHE (7 pins)
GND: MAIN_SCHE (22 pins), MCU_STM32_SCHE (44 pins), MICROSD (C48.1 C49.1 Micro_SD_Card1.6), SIM_SCHE (41 pins), ETHERNET (26 pins), GPS_SCHE (21 pins)
CTL_MODE_GPS: MCU_STM32_SCHE (STM1.85), GPS_SCHE (R30.1)
DRIVERSIM: MCU_STM32_SCHE (STM1.70), SIM_SCHE (R70.2)
DRV_ETHERNET_MODE: MCU_STM32_SCHE (STM1.59), ETHERNET (R16.1)
DRV_RST_GPS: MCU_STM32_SCHE (STM1.84), GPS_SCHE (R24.1)
MCRXD_SIM: MCU_STM32_SCHE (R48.1 R49.1), SIM_SCHE (C53.3 SIM_M1.22)
MCTXD_SIM: MCU_STM32_SCHE (R47.1), SIM_SCHE (C53.2 SIM_M1.21)
MCU_RXD_GPS: MCU_STM32_SCHE (STM1.79), GPS_SCHE (*1.2 C14.3)
MCU_TXD_GPS: MCU_STM32_SCHE (STM1.78), GPS_SCHE (*1.3 C14.2)
MISO: MCU_STM32_SCHE (STM1.31), MICROSD (Micro_SD_Card1.7 R61.2)
MOSI: MCU_STM32_SCHE (STM1.32), MICROSD (Micro_SD_Card1.3 R59.2)
NSS: MCU_STM32_SCHE (STM1.29), MICROSD (Micro_SD_Card1.2 R58.2)
OSC_1: MCU_STM32_SCHE (STM1.24), ETHERNET (1.3 R5.2)
RMII_CRS_DV: MCU_STM32_SCHE (STM1.55), ETHERNET (U1.40)
RMII_MDC: MCU_STM32_SCHE (STM1.16), ETHERNET (U1.31)
RMII_MDIO: MCU_STM32_SCHE (STM1.25), ETHERNET (R1.2 U1.30)
RMII_RXD0: MCU_STM32_SCHE (STM1.56), ETHERNET (U1.43)
RMII_RXD1: MCU_STM32_SCHE (STM1.57), ETHERNET (U1.44)
RMII_TX_EN: MCU_STM32_SCHE (STM1.48), ETHERNET (U1.2)
RMII_TXD0: MCU_STM32_SCHE (STM1.51), ETHERNET (U1.3)
RMII_TXD1: MCU_STM32_SCHE (STM1.52), ETHERNET (U1.4)
SCK: MCU_STM32_SCHE (STM1.30), MICROSD (Micro_SD_Card1.5 R60.2)
V_IN: MAIN_SCHE (6 pins), MCU_STM32_SCHE (U3.4 U4.4 U5.4 U6.4)